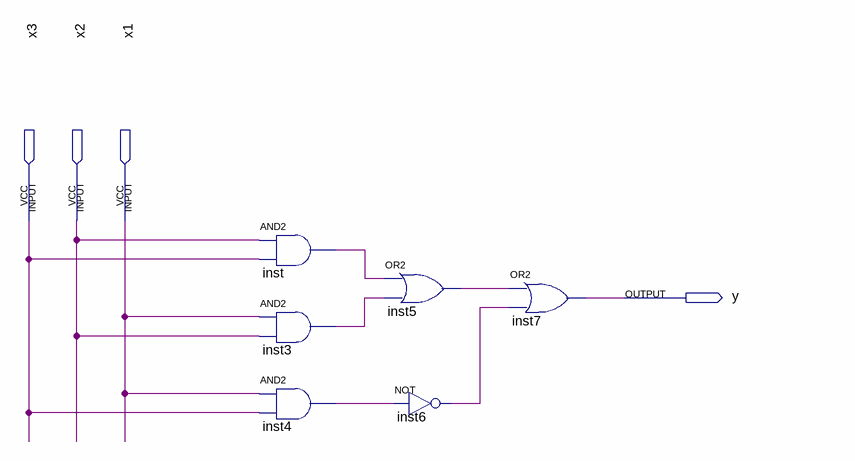
[diagram p0: schematic sheet]
// Quartus schematic L0101.bdf as structural Verilog: 6 symbols, 4 pins
module L0101 (
  input  x3,
  input  x2,
  input  x1,
  output y
);

  wire inst3_out, inst4_out, inst5_out, inst6_out, inst_out;

  and inst (inst_out, x2, x3);
  and inst3 (inst3_out, x1, x2);
  and inst4 (inst4_out, x1, x3);
  or inst5 (inst5_out, inst_out, inst3_out);
  not inst6 (inst6_out, inst4_out);
  or inst7 (y, inst5_out, inst6_out);
endmodule
